# Altium schematic sheet Server_CPU_Power_Supplies.SchDoc
size D
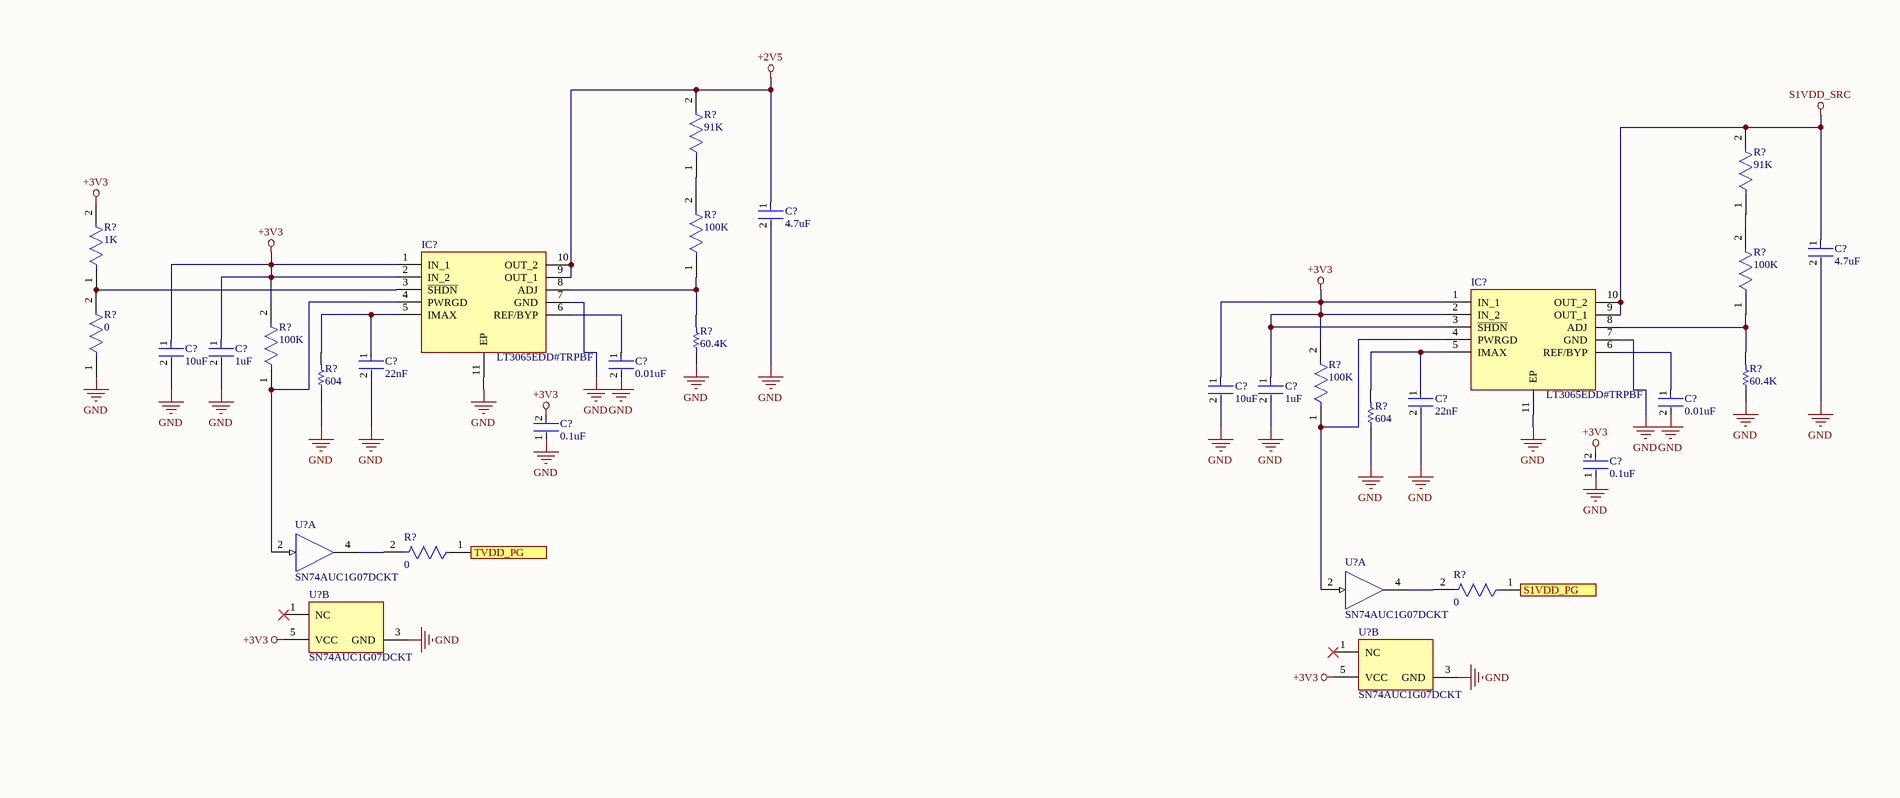
[diagram p0: Server_CPU_Power_Supplies.SchDoc, top left]
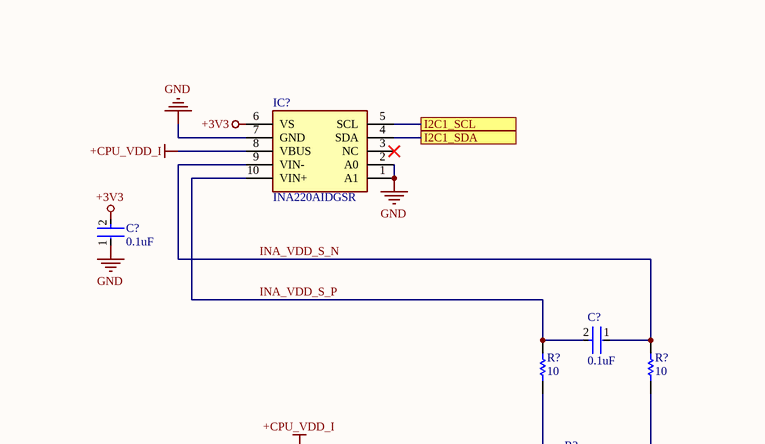
[diagram p1: Server_CPU_Power_Supplies.SchDoc, top right]
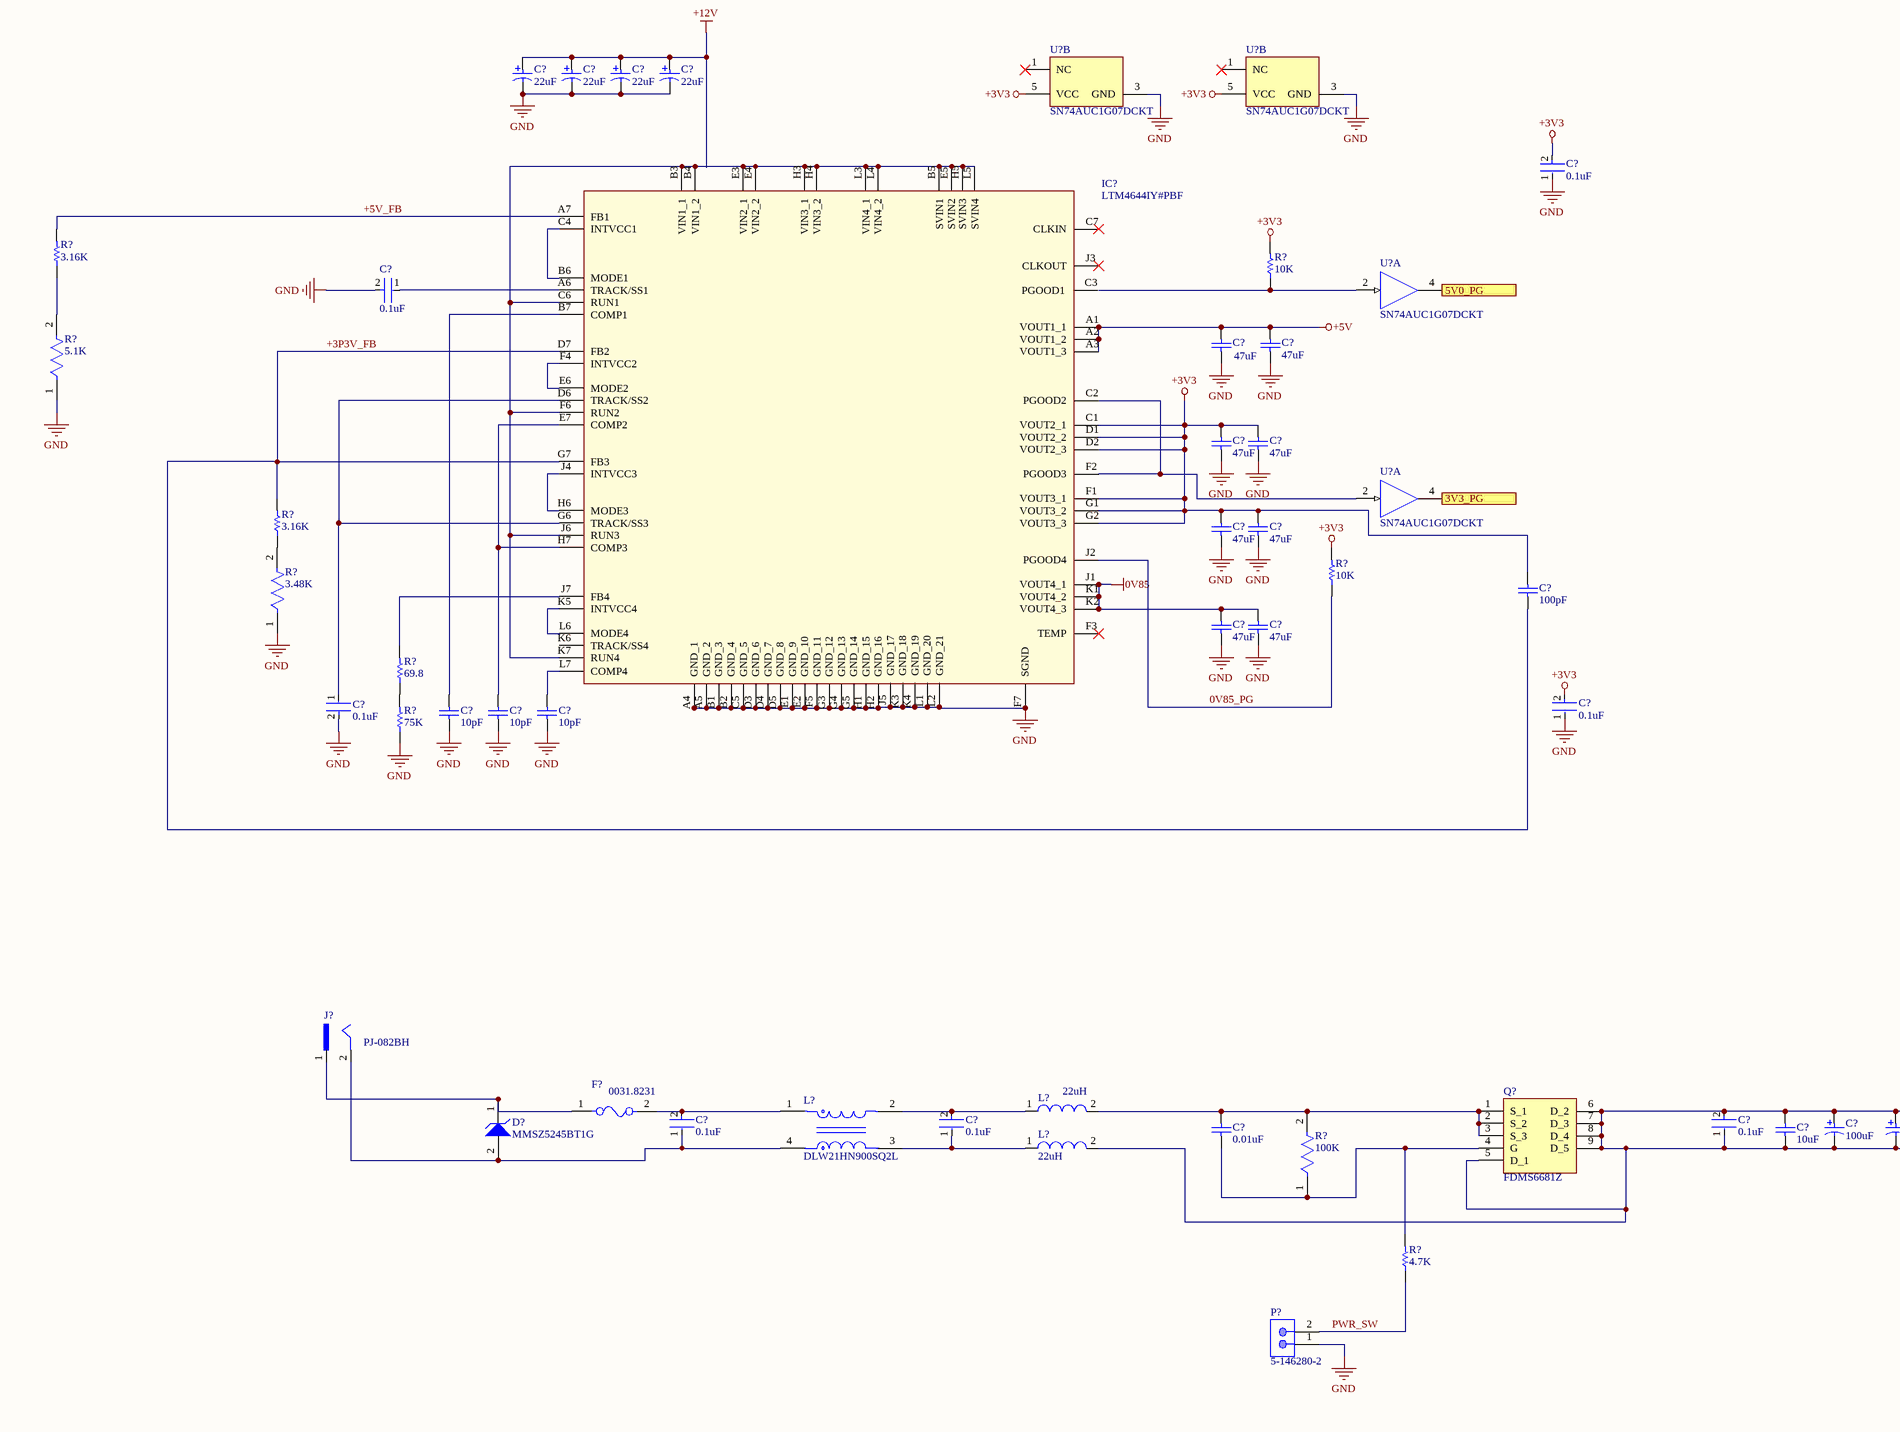
[diagram p2: Server_CPU_Power_Supplies.SchDoc, bottom left]
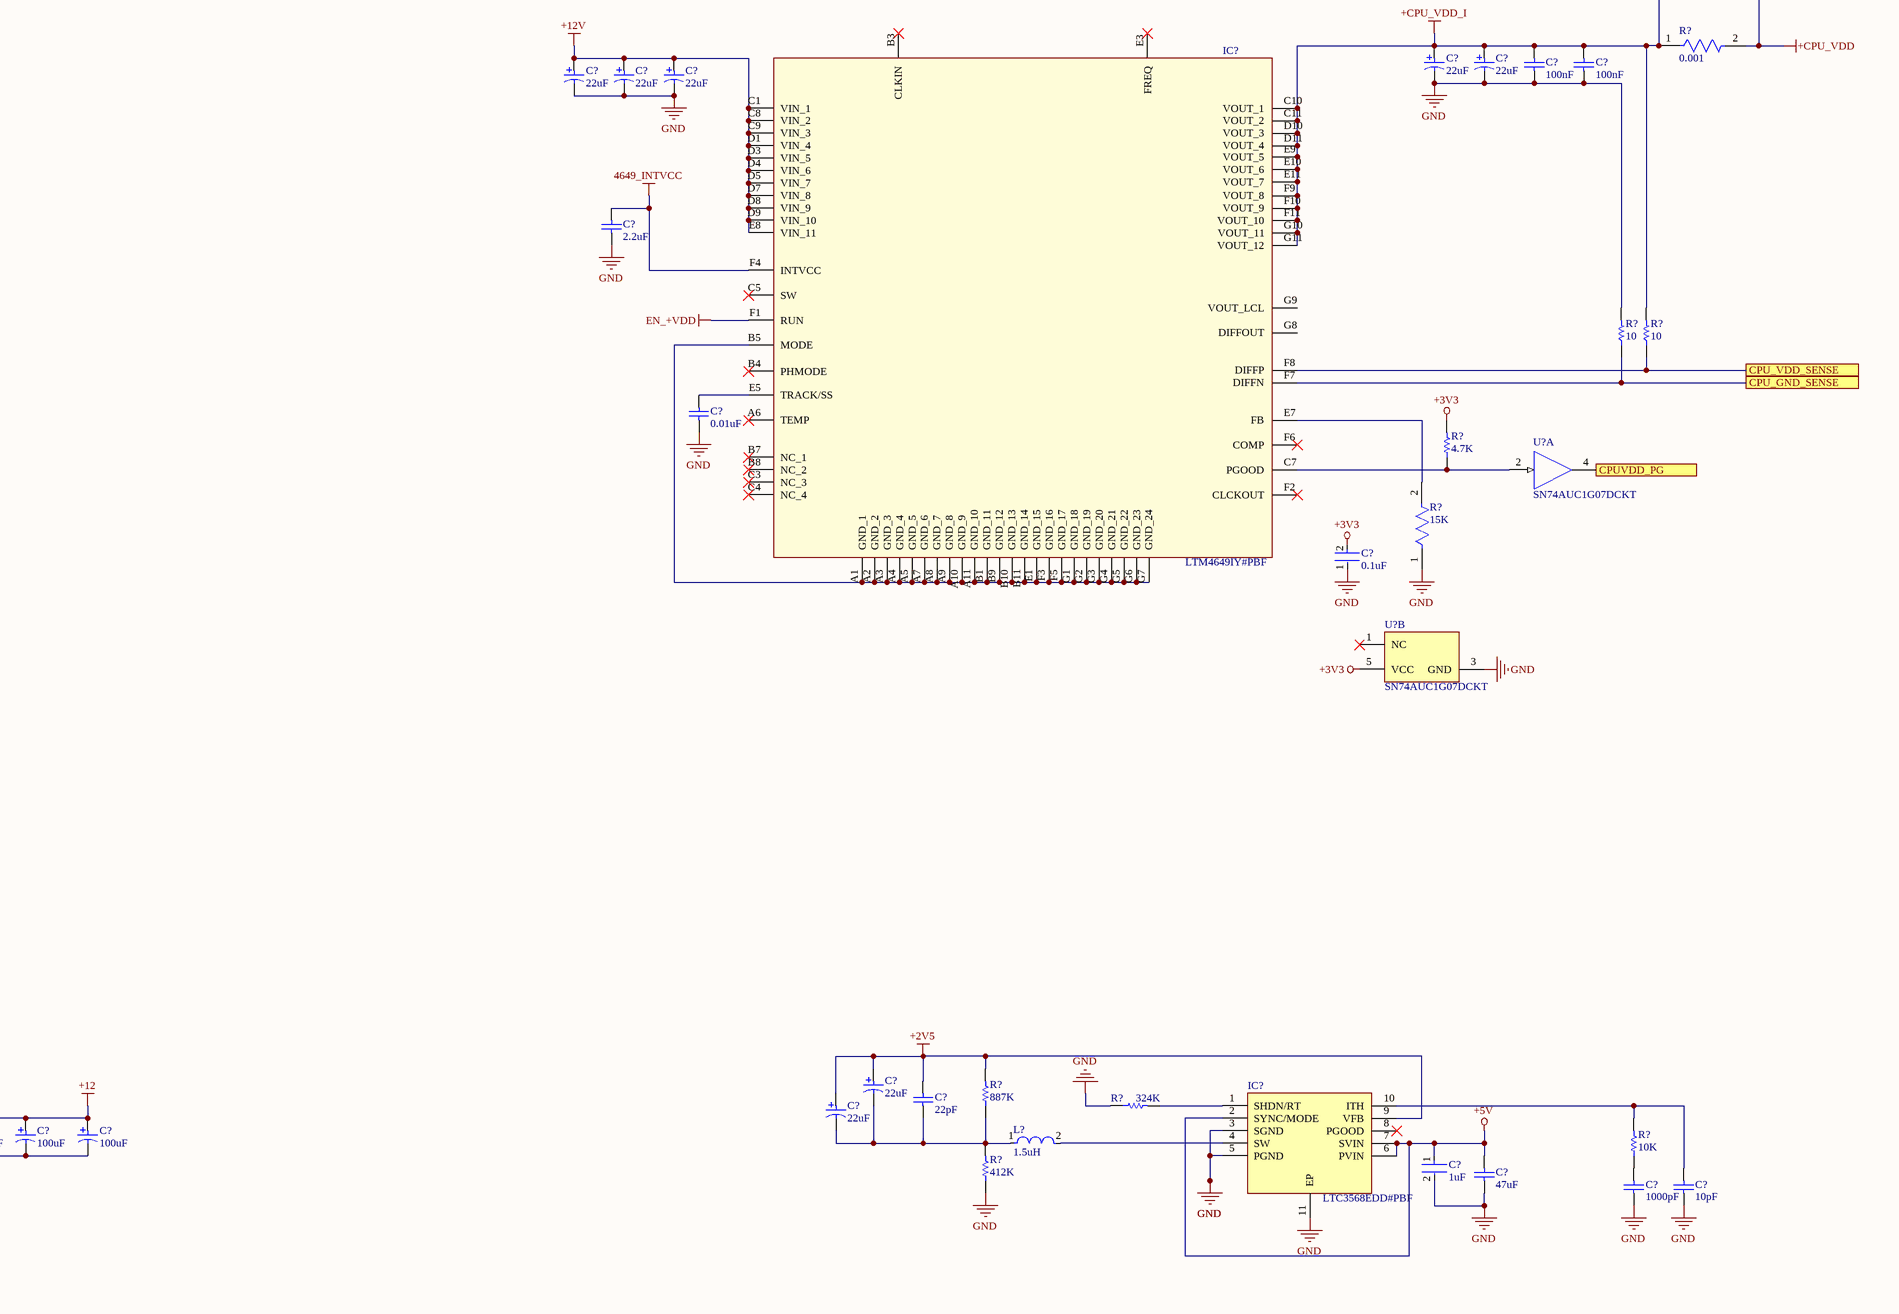
[diagram p3: Server_CPU_Power_Supplies.SchDoc, bottom right]

## Parts
(Parts that share a designator on the sheet are numbered #1, #2 ... from top to bottom, then left to right.)
C?#1  4.7uF  [FP-GRM155-0_1-IPC_B]
C?#2  4.7uF  [FP-GRM155-0_1-IPC_B]
C?#3  10uF  [FP-C0805C-DG-MFG]
C?#4  1uF  [FP-GRM15-0_1-MFG]
C?#5  22nF  [FP-CL288-IPC_C]
C?#6  0.01uF  [FP-C0402-BB-MFG]
C?#7  10uF  [FP-C0805C-DG-MFG]
C?#8  1uF  [FP-GRM15-0_1-MFG]
C?#9  22nF  [FP-CL288-IPC_C]
C?#10  0.01uF  [FP-C0402-BB-MFG]
C?#11  0.1uF  [FP-GRM15-MFG]
C?#12  0.1uF  [FP-GRM15-MFG]
C?#13  0.1uF  [FP-GRM15-MFG]
C?#14  0.1uF  [FP-GRM15-MFG]
C?#15  22uF  [AVX-TAJ-B-2_M]
C?#16  22uF  [AVX-TAJ-B-2_M]
C?#17  22uF  [AVX-TAJ-B-2_M]
C?#18  22uF  [AVX-TAJ-B-2_M]
C?#19  22uF  [AVX-TAJ-B-2_M]
C?#20  22uF  [AVX-TAJ-B-2_M]
C?#21  22uF  [AVX-TAJ-B-2_M]
C?#22  22uF  [AVX-TAJ-B-2_M]
C?#23  22uF  [AVX-TAJ-B-2_M]
C?#24  100nF  [CAPC3216X95X55ML15T25]
C?#25  100nF  [CAPC3216X95X55ML15T25]
C?#26  0.1uF  [FP-GRM15-MFG]
C?#27  2.2uF  [CAPC2013X140X50LL20T25]
C?#28  0.1uF  [FP-GRM15-MFG]
C?#29  47uF  [TAYO-JMK212BBJ476MG-T_L]
C?#30  47uF  [TAYO-JMK212BBJ476MG-T_L]
C?#31  0.01uF  [CAPC1005X56X25LL10T15]
C?#32  47uF  [TAYO-JMK212BBJ476MG-T_L]
C?#33  47uF  [TAYO-JMK212BBJ476MG-T_L]
C?#34  47uF  [TAYO-JMK212BBJ476MG-T_L]
C?#35  47uF  [TAYO-JMK212BBJ476MG-T_L]
C?#36  0.1uF  [FP-GRM15-MFG]
C?#37  100pF  [CAPC1005X55X25ML05T10]
C?#38  47uF  [TAYO-JMK212BBJ476MG-T_L]
C?#39  47uF  [TAYO-JMK212BBJ476MG-T_L]
C?#40  0.1uF  [FP-GRM15-MFG]
C?#41  0.1uF  [FP-GRM15-MFG]
C?#42  10pF  [CAPC1005X55X25ML05T10]
C?#43  10pF  [CAPC1005X55X25ML05T10]
C?#44  10pF  [CAPC1005X55X25ML05T10]
C?#45  22uF  [AVX-TAJ-B-2_M]
C?#46  22uF  [AVX-TAJ-B-2_M]
C?#47  22pF  [CAPC1005X55X25ML05T10]
C?#48  0.1uF  [FP-GRM15-MFG]
C?#49  0.1uF  [FP-GRM15-MFG]
C?#50  0.1uF  [FP-GRM15-MFG]
C?#51  100uF  [PNSC-FK-V-D8_V]
C?#52  100uF  [PNSC-FK-V-D8_V]
C?#53  100uF  [PNSC-FK-V-D8_V]
C?#54  0.01uF  [CAPC1005X56X25LL10T15]
C?#55  10uF  [CAPC1210(3225)190_N]
C?#56  1uF  [FP-GRM15-0_1-MFG]
C?#57  47uF  [CAPC1206(3216)190_N]
C?#58  1000pF  [CAPC1005X55X25ML5T10]
C?#59  10pF  [CAPC1005X55X25ML05T10]
D?  MMSZ5245BT1G  [ONSC-SOD-123-2-425-04_V]
F?  0031.8231  [FP-0031_8231-MFG]
IC?#1  LT3065EDD#TRPBF  [SON50P300X300X80-11N-D]
IC?#2  LT3065EDD#TRPBF  [SON50P300X300X80-11N-D]
IC?#3  INA220AIDGSR  [SOP50P490X110-10N]
IC?#4  LTM4649IY#PBF  [BGA68C127P11X7_1500X900X512]
IC?#5  LTM4644IY#PBF  [BGA77C127P7X11_900X1500X521]
IC?#6  LTC3568EDD#PBF  [SON50P300X300X80-11N-D]
J?  PJ-082BH  [CUI_PJ-082BH]
L?#1  22uH  [WE-HCI-1365]
L?#2  DLW21HN900SQ2L  [FP-DLW21HN-MFG]
L?#3  22uH  [WE-HCI-1365]
L?#4  1.5uH  [FP-IHLP-6767GZ-FP_3_825x1-MFG]
P?  5-146280-2  [TECO-5-146280-2_V]
Q?  FDMS6681Z  [FDMS6681Z]
R?#1  91K  [FP-CRCW0402-e3-IPC_B]
R?#2  91K  [FP-CRCW0402-e3-IPC_B]
R?#3  100K  [FP-CRCW0402-e3-IPC_C]
R?#4  1K  [FP-CRCW0402-e3-MFG]
R?#5  100K  [FP-CRCW0402-e3-IPC_C]
R?#6  60.4K  [RESC1005X40X25NL05T05]
R?#7  0  [FP-CRCW0402-e3-IPC_C]
R?#8  100K  [FP-CRCW0402-e3-IPC_C]
R?#9  604  [RESC1005X40X25ML05T05]
R?#10  60.4K  [RESC1005X40X25NL05T05]
R?#11  100K  [FP-CRCW0402-e3-IPC_C]
R?#12  604  [RESC1005X40X25ML05T05]
R?#13  0  [FP-CRCW0402-e3-IPC_C]
R?#14  0  [FP-CRCW0402-e3-IPC_C]
R?#15  10  [RESC1005X40X25LL05T05]
R?#16  10  [RESC1005X40X25LL05T05]
R?#17  0.001  [FP-HCS3920FT1L00-MFG]
R?#18  3.16K  [RESC1005X35X20NL05T10]
R?#19  10K  [RESC1005X40X25LL05T05]
R?#20  10  [RESC1005X40X25LL05T05]
R?#21  10  [RESC1005X40X25LL05T05]
R?#22  5.1K  [FP-CRCW0402-e3-IPC_C]
R?#23  4.7K  [RESC1005X40X25ML05T05]
R?#24  3.16K  [RESC1005X35X20NL05T10]
R?#25  15K  [FP-ERJ2R-MFG]
R?#26  10K  [RESC1005X40X25LL05T05]
R?#27  3.48K  [FP-CRCW0402-e3-IPC_C]
R?#28  69.8  [RESC1005X40X25LL05T05]
R?#29  75K  [RESC1005X40X25LL05T05]
R?#30  887K  [RESC1005X40X25ML05T05]
R?#31  324K  [RESC1005X40X25LL05T05]
R?#32  10K  [RESC1005X40X25LL05T05]
R?#33  412K  [RESC1005X40X25LL05T05]
R?#34  100K  [FP-CRCW0805-e3-MFG]
R?#35  4.7K  [RESC1005X40X25LL05T05]
U?#1  SN74AUC1G07DCKT  [DCK0005A_M]  (part A of 2)
U?#2  SN74AUC1G07DCKT  [DCK0005A_M]  (part A of 2)
U?#3  SN74AUC1G07DCKT  [DCK0005A_M]  (part B of 2)
U?#4  SN74AUC1G07DCKT  [DCK0005A_M]  (part B of 2)
U?#5  SN74AUC1G07DCKT  [DCK0005A_M]  (part B of 2)
U?#6  SN74AUC1G07DCKT  [DCK0005A_M]  (part B of 2)
U?#7  SN74AUC1G07DCKT  [DCK0005A_M]  (part A of 2)
U?#8  SN74AUC1G07DCKT  [DCK0005A_M]  (part A of 2)
U?#9  SN74AUC1G07DCKT  [DCK0005A_M]  (part A of 2)
U?#10  SN74AUC1G07DCKT  [DCK0005A_M]  (part B of 2)

## Ports
3V3_PG, 5V0_PG, CPU_GND_SENSE, CPU_VDD_SENSE, CPUVDD_PG, I2C1_SCL, I2C1_SDA, S1VDD_PG, TVDD_PG

## Nets
0V85: C?#38.2 C?#39.2 IC?#5.J1(VOUT4_1) IC?#5.K1(VOUT4_2) IC?#5.K2(VOUT4_3)
4649_INTVCC: C?#27.2 IC?#4.F4(INTVCC)
+2V5: C?#1.1 C?#45.1 C?#46.1 C?#47.2 IC?#1.9(OUT_1) IC?#1.10(OUT_2) IC?#6.9(VFB) R?#1.2 R?#30.2
+3V3: C?#3.1 C?#4.1 C?#7.1 C?#8.1 C?#11.2 C?#12.2 C?#13.2 C?#26.2 C?#32.2 C?#33.2 C?#34.2 C?#35.2 C?#36.2 C?#37.2 C?#40.2 IC?#1.1(IN_1) IC?#1.2(IN_2) IC?#2.1(IN_1) IC?#2.2(IN_2) IC?#2.3(~{SHDN}) IC?#3.6(VS) IC?#5.C1(VOUT2_1) IC?#5.D1(VOUT2_2) IC?#5.D2(VOUT2_3) IC?#5.F1(VOUT3_1) IC?#5.G1(VOUT3_2) IC?#5.G2(VOUT3_3) R?#4.2 R?#8.2 R?#11.2 R?#19.2 R?#23.2 R?#26.2 U?#3.5(VCC) U?#4.5(VCC) U?#5.5(VCC) U?#6.5(VCC) U?#10.5(VCC)
+5V: C?#29.2 C?#30.2 C?#56.1 C?#57.2 IC?#5.A1(VOUT1_1) IC?#5.A2(VOUT1_2) IC?#5.A3(VOUT1_3) IC?#6.2(SYNC/MODE) IC?#6.6(PVIN) IC?#6.7(SVIN)
+12: C?#50.1 C?#50.2 C?#51.1 C?#51.2 C?#52.1 C?#52.2 C?#53.1 C?#53.2 C?#55.1 C?#55.2 L?#3.2 Q?.5(D_1) Q?.6(D_2) Q?.7(D_3) Q?.8(D_4) Q?.9(D_5)
+12V: C?#15.1 C?#16.1 C?#17.1 C?#18.1 C?#21.1 C?#22.1 C?#23.1 IC?#4.C1(VIN_1) IC?#4.C8(VIN_2) IC?#4.C9(VIN_3) IC?#4.D1(VIN_4) IC?#4.D3(VIN_5) IC?#4.D4(VIN_6) IC?#4.D5(VIN_7) IC?#4.D7(VIN_8) IC?#4.D8(VIN_9) IC?#4.D9(VIN_10) IC?#4.E8(VIN_11)
+CPU_VDD: R?#16.1 R?#17.2
+CPU_VDD_I: C?#19.1 C?#20.1 C?#24.2 C?#25.2 IC?#3.8(VBUS) IC?#4.C10(VOUT_1) IC?#4.C11(VOUT_2) IC?#4.D10(VOUT_3) IC?#4.D11(VOUT_4) IC?#4.E9(VOUT_5) IC?#4.E10(VOUT_6) IC?#4.E11(VOUT_7) IC?#4.F9(VOUT_8) IC?#4.F10(VOUT_9) IC?#4.F11(VOUT_10) IC?#4.G10(VOUT_11) IC?#4.G11(VOUT_12) R?#15.1 R?#17.1 R?#21.2
EN_+VDD: IC?#4.F1(RUN)
GND: C?#1.2 C?#2.2 C?#3.2 C?#4.2 C?#5.2 C?#6.2 C?#7.2 C?#8.2 C?#9.2 C?#10.2 C?#11.1 C?#12.1 C?#13.1 C?#15.2 C?#16.2 C?#17.2 C?#18.2 C?#19.2 C?#20.2 C?#21.2 C?#22.2 C?#23.2 C?#24.1 C?#25.1 C?#26.1 C?#27.1 C?#28.2 C?#29.1 C?#30.1 C?#31.1 C?#32.1 C?#33.1 C?#34.1 C?#35.1 C?#36.1 C?#38.1 C?#39.1 C?#40.1 C?#41.2 C?#42.1 C?#43.1 C?#44.1 C?#56.2 C?#57.1 C?#58.1 C?#59.1 IC?#1.7(GND) IC?#1.11(EP) IC?#2.7(GND) IC?#2.11(EP) IC?#3.1(A1) IC?#3.2(A0) IC?#3.7(GND) IC?#5.A4(GND_1) IC?#5.A5(GND_2) IC?#5.B1(GND_3) IC?#5.B2(GND_4) IC?#5.C5(GND_5) IC?#5.D3(GND_6) IC?#5.D4(GND_7) IC?#5.D5(GND_8) IC?#5.E1(GND_9) IC?#5.E2(GND_10) IC?#5.F5(GND_11) IC?#5.F7(SGND) IC?#5.G3(GND_12) IC?#5.G4(GND_13) IC?#5.G5(GND_14) IC?#5.H1(GND_15) IC?#5.H2(GND_16) IC?#5.J5(GND_17) IC?#5.K3(GND_18) IC?#5.K4(GND_19) IC?#5.L1(GND_20) IC?#5.L2(GND_21) IC?#6.3(SGND) IC?#6.5(PGND) IC?#6.11(EP) P?.1 R?#6.1 R?#7.1 R?#9.1 R?#10.1 R?#12.1 R?#20.2 R?#22.1 R?#25.1 R?#27.1 R?#29.1 R?#31.1 R?#33.1 U?#3.3(GND) U?#4.3(GND) U?#5.3(GND) U?#6.3(GND) U?#10.3(GND)
S1VDD_SRC: C?#2.1 IC?#2.9(OUT_1) IC?#2.10(OUT_2) R?#2.2
0V85_PG: IC?#5.J2(PGOOD4) R?#26.1
3V3_PG: U?#9.4(Y) ; port 3V3_PG
5V0_PG: U?#7.4(Y) ; port 5V0_PG
+3P3V_FB: C?#37.1 IC?#5.D7(FB2) IC?#5.G7(FB3) R?#24.2
+5V_FB: IC?#5.A7(FB1) R?#18.2
CPU_GND_SENSE: IC?#4.F7(DIFFN) R?#20.1 ; port CPU_GND_SENSE
CPU_VDD_SENSE: IC?#4.F8(DIFFP) R?#21.1 ; port CPU_VDD_SENSE
CPUVDD_PG: U?#8.4(Y) ; port CPUVDD_PG
I2C1_SCL: IC?#3.5(SCL) ; port I2C1_SCL
I2C1_SDA: IC?#3.4(SDA) ; port I2C1_SDA
INA_VDD_S_N: C?#14.1 IC?#3.9(VIN-) R?#16.2
INA_VDD_S_P: C?#14.2 IC?#3.10(VIN+) R?#15.2
PWR_SW: P?.2 R?#35.1
S1VDD_PG: R?#14.1 ; port S1VDD_PG
TVDD_PG: R?#13.1 ; port TVDD_PG
NetC?#5_1: C?#5.1 IC?#1.5(IMAX) R?#9.2
NetC?#6_1: C?#6.1 IC?#1.6(REF/BYP)
NetC?#9_1: C?#9.1 IC?#2.5(IMAX) R?#12.2
NetC?#10_1: C?#10.1 IC?#2.6(REF/BYP)
NetC?#28_1: C?#28.1 IC?#5.A6(TRACK/SS1)
NetC?#31_2: C?#31.2 IC?#4.E5(TRACK/SS)
NetC?#41_1: C?#41.1 IC?#5.D6(TRACK/SS2) IC?#5.G6(TRACK/SS3)
NetC?#42_2: C?#42.2 IC?#5.B7(COMP1)
NetC?#43_2: C?#43.2 IC?#5.E7(COMP2) IC?#5.H7(COMP3)
NetC?#44_2: C?#44.2 IC?#5.L7(COMP4)
NetC?#45_2: C?#45.2 C?#46.2 C?#47.1 L?#4.1 R?#30.1 R?#33.2
NetC?#48_1: C?#48.1 D?.2(A) J?.2 L?#2.4
NetC?#48_2: C?#48.2 F?.2 L?#2.1
NetC?#49_1: C?#49.1 L?#2.3 L?#3.1
NetC?#49_2: C?#49.2 L?#1.1 L?#2.2
NetC?#54_1: C?#54.1 Q?.4(G) R?#34.1 R?#35.2
NetC?#54_2: C?#54.2 L?#1.2 Q?.1(S_1) Q?.2(S_2) Q?.3(S_3) R?#34.2
NetC?#58_2: C?#58.2 R?#32.1
NetC?#59_2: C?#59.2 IC?#6.10(ITH) R?#32.2
NetD?_1: D?.1(K) F?.1 J?.1
NetIC?#1_3: IC?#1.3(~{SHDN}) R?#4.1 R?#7.2
NetIC?#1_4: IC?#1.4(PWRGD) R?#8.1 U?#1.2(A)
NetIC?#1_8: IC?#1.8(ADJ) R?#3.1 R?#6.2
NetIC?#2_4: IC?#2.4(PWRGD) R?#11.1 U?#2.2(A)
NetIC?#2_8: IC?#2.8(ADJ) R?#5.1 R?#10.2
NetIC?#4_A1: IC?#4.A1(GND_1) IC?#4.A2(GND_2) IC?#4.A3(GND_3) IC?#4.A4(GND_4) IC?#4.A5(GND_5) IC?#4.A7(GND_6) IC?#4.A8(GND_7) IC?#4.A9(GND_8) IC?#4.A10(GND_9) IC?#4.A11(GND_10) IC?#4.B1(GND_11) IC?#4.B5(MODE) IC?#4.B9(GND_12) IC?#4.B10(GND_13) IC?#4.B11(GND_14) IC?#4.E1(GND_15) IC?#4.F3(GND_16) IC?#4.F5(GND_17) IC?#4.G1(GND_18) IC?#4.G2(GND_19) IC?#4.G3(GND_20) IC?#4.G4(GND_21) IC?#4.G5(GND_22) IC?#4.G6(GND_23) IC?#4.G7(GND_24)
NetIC?#4_C7: IC?#4.C7(PGOOD) R?#23.1 U?#8.2(A)
NetIC?#4_E7: IC?#4.E7(FB) R?#25.2
NetIC?#5_B3: IC?#5.B3(VIN1_1) IC?#5.B4(VIN1_2) IC?#5.B5(SVIN1) IC?#5.C6(RUN1) IC?#5.E3(VIN2_1) IC?#5.E4(VIN2_2) IC?#5.E5(SVIN2) IC?#5.F6(RUN2) IC?#5.H3(VIN3_1) IC?#5.H4(VIN3_2) IC?#5.H5(SVIN3) IC?#5.J6(RUN3) IC?#5.K7(RUN4) IC?#5.L3(VIN4_1) IC?#5.L4(VIN4_2) IC?#5.L5(SVIN4)
NetIC?#5_B6: IC?#5.B6(MODE1) IC?#5.C4(INTVCC1)
NetIC?#5_C2: IC?#5.C2(PGOOD2) IC?#5.F2(PGOOD3) U?#9.2(A)
NetIC?#5_E6: IC?#5.E6(MODE2) IC?#5.F4(INTVCC2)
NetIC?#5_H6: IC?#5.H6(MODE3) IC?#5.J4(INTVCC3)
NetIC?#5_J7: IC?#5.J7(FB4) R?#28.2
NetIC?#5_K5: IC?#5.K5(INTVCC4) IC?#5.L6(MODE4)
NetIC?#6_1: IC?#6.1(SHDN/RT) R?#31.2
NetIC?#6_4: IC?#6.4(SW) L?#4.2
NetR?#1_1: R?#1.1 R?#3.2
NetR?#2_1: R?#2.1 R?#5.2
NetR?#13_2: R?#13.2 U?#1.4(Y)
NetR?#14_2: R?#14.2 U?#2.4(Y)
NetR?#18_1: R?#18.1 R?#22.2
NetR?#19_1: R?#19.1 U?#7.2(A)
NetR?#24_1: R?#24.1 R?#27.2
NetR?#28_1: R?#28.1 R?#29.2

Not connected (* = marked no-connect by the designer): IC?#3 3(NC)*; IC?#4 A6(TEMP)* B3(CLKIN)* B4(PHMODE)* B7(NC_1)* B8(NC_2)* C3(NC_3)* C4(NC_4)* C5(SW)* E3(FREQ)* F2(CLCKOUT)* F6(COMP)* G8(DIFFOUT) G9(VOUT_LCL); IC?#5 C3(PGOOD1) C7(CLKIN)* F3(TEMP)* J3(CLKOUT)* K6(TRACK/SS4); IC?#6 8(PGOOD)*; U?#3 1(NC)*; U?#4 1(NC)*; U?#5 1(NC)*; U?#6 1(NC)*; U?#10 1(NC)*

## Notes on the sheet
- Title
- Size:
- Date:
- File:
- D
- Number:
- Time:
- Revision:
- Sheet
- of

## Library data of the parts
C?#1 C?#2 = CMP-2008-04549-2: Chip Multilayer Ceramic Capacitors for General Purpose, 0402, 4.7uF, X5R, 15%, 20%, 6.3V; Height: 0.5mm; Weight: 0.000212oz; Length: 1mm; Case Code (Metric): 1005; Packaging: Tape and Reel; Termination: SMD/SMT; Dielectric: X5R; Depth: 0.5mm; Case Code (Imperial): 0402; Min Operating Temperature: -55°C; Case/Package: 0402; Voltage: 6.3V; Width: 0.02inch; Capacitance: 4.7uF; Lead Free: Lead Free; Thickness: 0.022inch; Contact Plating: Tin; REACH SVHC: No SVHC; Package Quantity: 10000; Tolerance: 20%; Voltage Rating (DC): 6.3V; Voltage Rating: 6.3V; Mount: Surface Mount; Max Operating Temperature: 85°C
C?#3 C?#7 = CMP-2007-03243-2: CAP CER 10UF 10V X5R 0805; Manufacturer Part Number: C0805C106K8PACTU; Manufacturer: Kemet; 3DS Part Number: 220-00001; Tolerance: 10%; Temperature Coefficient: 15%; Material: Ceramic; Device Class L2: Capacitors; Device Class L1: Passive Components; ComponentLink2URL: https://content.kemet.com/datasheets/KEM_C1006_X5R_SMD.pdf; Height: 1.4mm; Lead Free: Yes; Digikey Description: CAP CER 10UF 10V X5R 0805; Octopart: https://octopart.com/c0805c106k8pactu-kemet-98697; Capacitance: 10uF; Value: 10uF; Temperature Range Low: -55°C; Temperature: -55°C to +85°C; Automotive: No; Mouser Description: CAP CER 10UF 10V X5R 0805; Ipc Land Pattern Name: CAPC200125X125; Temperature Range High: +85°C; Voltage: 10V; RoHS: TRUE; Device Class L3: Ceramic Capacitors; ComponentLink2Description: Datasheet; Voltage Rating: 10V; Package: C0805C-DG; Temperature Characteristic: X5R; Category: Cap
C?#4 C?#8 C?#56 = CMP-2008-04556-2: CAP CER 1UF 10V X5R 0402; Manufacturer Part Number: GRM155R61A105KE15D; Manufacturer: Murata; Material: Ceramic; Tolerance: 10%; Temperature Coefficient: 15%; Octopart: https://octopart.com/grm155r61a105ke15d-murata-197442; Lead Free: Yes; ComponentLink2Description: Datasheet; Temperature: -55°C to +85°C; Temperature Range High: +85°C; Height: 0.55mm; Capacitance: 1uF; Ipc Land Pattern Name: CAPC10050X50; ComponentLink2URL: https://search.murata.co.jp/Ceramy/image/img/A01X/G101/ENG/GRM155R61A105KE15-01A.pdf; Temperature Range Low: -55°C; Device Class L2: Capacitors; Voltage Rating: 10V; RoHS: TRUE; Device Class L1: Passive Components; Device Class L3: Ceramic Capacitors; Temperature Characteristic: X5R; Mouser Description: 0402 1 uF 10 V ±10% Tolerance X5R Surface Mount Multilayer Ceramic Capacitor; Automotive: No; Package: GRM15-0.1; Digikey Description: CAP CER 1UF 10V X5R 0402; Value: 1uF; Category: Cap
C?#5 C?#9 = CMP-13271-003253-1: Cap Ceramic 22nF 16V X7R ±10% SMD 0402 +125°C Paper T/R; Width: 0.02inch; Mount: Surface Mount; Radiation Hardening: No; Case Code (Imperial): 0402; Thickness: 0.022inch; Height: 0.5mm; Tolerance: 10%; Length: 1mm; Packaging: Tape and Reel; Contact Plating: Tin; Case/Package: 0402; Min Operating Temperature: -55°C; Voltage: 16V; Voltage Rating: 16V; Package Quantity: 1; Case Code (Metric): 1005; Depth: 0.5mm; Capacitance: 22nF; Max Operating Temperature: 125°C; Dielectric: X7R
C?#6 C?#10 = CMP-2008-03072-2: CAP CER 10000PF 16V X7R 0402; Manufacturer Part Number: C0402C103K4RACTU; Manufacturer: Kemet; Tolerance: 0.1; Material: Ceramic; Value: 10,000 pF; Temperature Coefficient: 15%; Package: C0402-BB; Height: 0.55mm; Temperature Range Low: -55°C; Lead Free: Yes; Mouser Description: Capacitor; Ceramic; Cap; .010uF; Tol 10%; SMT; Vol-Rtg 16V; X7R; Tape and Reel; RoHS: TRUE; Capacitance: 10,000 pF; Device Class L3: Ceramic Capacitors; Voltage Rating: 16 V; Automotive: No; Temperature: -55°C to +125°C; Digikey Description: CAP CER 10000PF 16V X7R 0402; Temperature Characteristic: X7R; Temperature Range High: +125°C; Category: Cap; Ipc Land Pattern Name: CAPC10050X50; ComponentLink2URL: https://content.kemet.com/datasheets/KEM_C1002_X7R_SMD.pdf; Octopart: https://octopart.com/c0402c103k4ractu-kemet-130896; ComponentLink2Description: Datasheet; Device Class L1: Passive Components; Device Class L2: Capacitors
C?#11-C?#14 C?#26 C?#28 C?#36 C?#40 C?#41 C?#48-C?#50 = CMP-2100-03641-2: CAP CER 0.1UF 16V X7R 0402; Manufacturer Part Number: GRM155R71C104KA88D; Manufacturer: Murata; Standoff Height: 0mm; Tolerance: 10%; Voltage Rating: 16Vdc; Material: Ceramic; Capacitance: 0.10μF; Value: 0.10μF; RoHS: TRUE; Temperature Characteristic: X7R; Octopart: https://octopart.com/grm155r71c104ka88d-murata-196880; Digikey Description: CAP CER 0.1UF 16V X7R 0402; Device Class L3: Ceramic Capacitors; Height: 0.55mm; ComponentLink2Description: Datasheet; Temperature Range Low: -55°C; Ipc Land Pattern Name: CAPC10050X219; ComponentLink2URL: https://search.murata.co.jp/Ceramy/image/img/A01X/G101/ENG/GRM155R71H471KA01-01A.pdf; Device Class L1: Passive Components; Lead Free: yes; Category: Cap; Package: GRM15; Temperature: -55°C to +125°C; Device Class L2: Capacitors; Temperature Range High: +125°C; Mouser Description: 0402 0.1 uF 16V ±10 % Tolerance X7R SMT Multilayer Ceramic Capacitor
C?#15-C?#23 C?#45 C?#46 = CMP-2100-03689-1: Standard Tantalum, 22 uF, +/- 10%, 16 V, -55 to 125 degC, 2-Pin SMD (1210), RoHS, Tape and Reel; Manufacturer: AVX; Leakage Current: 3.5uA; Dissipation Factor: 6%; Voltage Rating (DC): 16V; ESR (Equivalent Series Resistance): 2.3Ohm; Polarity: Polar; Package Quantity: 1; Tolerance: 10%; Number of Pins: 2; Manufacturer URL: http://www.avx.com/; Height - Seated (Max): 0.083inch; Case Code (Imperial): 1210; Package Reference: TAJ-B-2; Height: 1.9mm; Depth: 2.8mm; Packaging: TapeandReel; Termination: SMD/SMT; Case/Package: 1210; Lead Free: LeadFree; Min Operating Temperature: -55degC; Capacitance: 22uF; RoHSCompliant: True; Dielectric Material: Tantalum; Case Code (Metric): 3528; Width: 2.8mm; Datasheet URL: http://datasheets.avx.com/TAJ.pdf; Radiation Hardening: No; Package Description: 2-Pin Surface Mount Device, Body 3.5 x 2.85 mm; Length: 3.5mm; Voltage Rating: 16V; Datasheet Version: 42401.0; Max Operating Temperature: 125degC; REACH SVHC: NoSVHC; Voltage: 16V
C?#24 C?#25 = CMP-1662-00007-4: Chip Capacitor, 0.1 uF, +/- 10%, 50 V, -55 to 125 degC, 1206 (3216 Metric), RoHS, Tape and Reel; Manufacturer: Murata; Voltage Rating: 50 V; Lead Pitch: 4 mm; PackageDescription: 2-Pin Surface Mount Device, Body 3.2 x 1.6 mm; DatasheetVersion: 03/2016; Min Operating Temperature: -55 degC; Package Quantity: 4000; RoHSCompliant: true; Max Operating Temperature: 125 degC; Height: 0.85 mm; Pins: 2; Length: 3.2 mm; PackageReference: 1206 (3216 Metric); Mounting Technology: Surface Mount; ComponentLink1Description: Manufacturer URL; ComponentLink2Description: Datasheet; ComponentLink1URL: http://www.murata.com/; Mount: Surface Mount; REACH SVHC: No SVHC; Packaging: Tape and Reel; ComponentLink2URL: http://search.murata.co.jp/Ceramy/image/img/A01X/G101/ENG/GRM319R71H104KA01-01.pdf
C?#27 = CMP-2000-05810-1: Chip Capacitor, 2.2 uF, +/- 10%, 10 V, -55 to 85 degC, 0805 (2012 Metric), RoHS, Tape and Reel; Manufacturer: AVX; Dielectric: X5R; Rated Voltage: 10V; Capacitance: 2.2µF; Tolerance (%): ±10%; Datasheet Version: 05/2016; Manufacturer URL: http://www.avx.com/; Package Description: 2-Pin Surface Mount Device, Body 2.01 x 1.25 mm; Mounting Technology: SurfaceMount; Case Size/Dimension: 0805; Package Reference: 0805; Datasheet URL: http://datasheets.avx.com/cx5r.pdf
C?#29 C?#30 C?#32-C?#35 C?#38 C?#39 = CMP-2000-06498-1: High Value Multilayer Ceramic Capacitor, 47 uF, +/-20%, 6.3 V, -55 to 85 degC, 2-Pin SMD (0805), RoHS, Tape and Reel; Manufacturer: Taiyo Yuden; PCN Part Number: X5R,X7RDielectrics23/Jan/2008; Kits: 587-1797-KIT-ND-KITCAPCERHICAP0603&0805S; Temperature Coefficient: X5R; Tolerance: ±20%; Online Catalog: MSeries; Other Names: 587-1779-1; Capacitance: 47µF; Voltage - Rated: 6.3V; Catalog Drawings: xMKSeries_0805_1.25; Operating Temperature: -55°C~85°C; Mounting Technology: SurfaceMount; Package Reference: 0805; Features: -; Lead Spacing: -; Lead Style: -; Family: CeramicCapacitors; Size / Dimension: 0.079"Lx0.049"W(2.00mmx1.25mm); Package Description: 2-Pin SMD, Body 2.2 x 1.45 mm; Mounting Type: SurfaceMount,MLCC; Package / Case: 0805(2012Metric); Series: M; Category: Capacitors; Packaging: CutTape(CT); Datasheet Version: 10/2015; Datasheet URL: http://datasheet.octopart.com/JMK212BJ476MG-T-Taiyo-Yuden-datasheet-62109412.pdf; Manufacturer URL: http://www.t-yuden.com/; Ratings: -; Height - Seated (Max): -; Standard Package: 1; Thickness (Max): 0.053"(1.35mm); Applications: GeneralPurpose
C?#31 C?#54 = CMP-2008-02796-1: Manufacturer: AVX Interconnect / Elco; Part Number: 0402YC103JAT2A
C?#37 = CMP-2008-03915-1: Manufacturer: Murata; Part Number: GRM1555C1H101JA01D
C?#42-C?#44 C?#59 = CMP-2008-04246-1: Part Number: GRM1555C1H100JZ01D; Manufacturer: Murata
C?#47 = CMP-2008-04304-1: Part Number: GRM1555C1H220JZ01D; Manufacturer: Murata
C?#51-C?#53 = CMP-2000-06206-1: Aluminum Electrolytic Capacitor, 100 uF, +/- 20%, 25 V, 2-Pin SMD (Size Code D8), -55 to 105 degC, RoHS, Tape and Reel; Manufacturer: Panasonic; Type: Can; Lifetime@Temperature: 2000Hrs@105°C; Capacitance: 100µF; Rated Voltage: 25V; Ripple Current: 280mA; Impedance: 0.34O; Case Size/Dimension: Ø6.3x7.7mm; Operating Temp-Max: 105°C; Series: FK; Package URL: http://industrial.panasonic.com/cdbs/www-data/pdf/RDE0000/DME0000COL48.pdf; Mounting Technology: SurfaceMount; Package Description: 2-Pin Electrolytic Aluminum Capacitor, Body 6.6 x 6.6 mm; Datasheet Version: 03/2016; Datasheet URL: http://industrial.panasonic.com/cdbs/www-data/pdf/RDE0000/ABA0000C1181.pdf; Manufacturer URL: http://www.panasonic.com/; Package Reference: FK-V-D8; Operating Temp Range: -55to+105°C
C?#55 = CMP-1038-02223-1: CAP 10uF 16V -20% to +80% 1210 (3225 Metric) Thickness 1.9mm SMD; Case-EIA: 1210; Case-Metric: 3225; Rated Voltage: 16 V; Tolerance: -20% to +80%; Value: 10uF; Technology: SMT; Max Thickness: 1.9 mm
C?#57 = CMP-1037-05002-1: CAP 47uF 10V ±20% 1206 (3216 Metric) Thickness 1.9mm SMD; Case-Metric: 3216; Case-EIA: 1206; Tolerance: Â±20%; Technology: SMT; Rated Voltage: 10 V; Value: 47uF; Max Thickness: 1.9 mm
C?#58 = CMP-1662-00017-1: Chip Capacitor, 1 nF, +/- 10%, 50 V, -55 to 125 degC, 0402 (1005 Metric), RoHS, Tape and Reel; Case\/Package: 0402; Type (Capacitors): X7R; Voltage Rating (DC): 50 V; Capacitance: 1 nF; Width: 0.5 mm; Pins: 2; REACH SVHC: No SVHC; Length: 1 mm; Height: 0.5 mm; PackageDescription: 2-Pin Surface Mount Device, Body 1 x 0.5 mm; DatasheetVersion: 07/2016; Mount: Surface Mount; ComponentLink2Description: Datasheet; Tolerance: 10%; ComponentLink2URL: http://psearch.en.murata.com/capacitor/product/GRM155R71H102KA01%23.pdf; ComponentLink1URL: http://www.murata.com/; Case Code (Metric): 1005; Package Quantity: 10000; Min Operating Temperature: -55 degC; Max Operating Temperature: 125 degC; Voltage Rating: 50 V; ComponentLink1Description: Manufacturer URL; Packaging: Tape and Reel; Radiation Hardening: No; RoHSCompliant: true; PackageReference: 0402; Mounting Technology: Surface Mount; Case Code (Imperial): 0402
D? = CMP-1060-00535-1: Zener Voltage Regulator, 500 mW, 2-Pin SOD-123, Pb-Free, Tape and Reel; Manufacturer: On Semiconductor; P Max (W): 0.5; VZ Typ (V): 15; ComponentLink3URL: http://www.onsemi.com/pub_link/Collateral/425-04.PDF; Packing: Tape and Reel; DatasheetVersion: Rev. 12; ComponentLink2URL: http://www.onsemi.com/pub_link/Collateral/MMSZ5221BT1-D.PDF; Mounting Technology: Surface Mount; ComponentLink1Description: Manufacturer URL; ComponentLink1URL: http://www.onsemi.com/; ComponentLink2Description: Datasheet; PackageVersion: Rev. G, 10/2009; PackageReference: SOD-123-2-425-04; PackageDescription: 2-Pin SOD, Body 1.6 x 2.69 mm; ComponentLink3Description: Package Specification; RoHS: Pb-Free; PartNumber: MMSZ5245BT1G
F? = CMP-26292-000005-1: FUSE BLOK CARTRIDGE 600V 16A PCB; Manufacturer: Schurter; Voltage Rating Ac: 500V; Number Of Fuses: 1; Standoff Height: 0.7mm; Conn Orientation: Horizontal; ComponentLink2URL: https://www.schurter.com/en/datasheet/typ_OGD.pdf; Voltage Rating Dc: 600V; Package: 0; Device Class L3: unset; Digikey Description: FUSE BLOK CARTRIDGE 600V 16A PCB; Mouser Description: Fuse Holder OGD FUSEHOLDER 5X20/6.3X32; Category: Fuse; Device Class L2: Fuse Holders; Height: 12.7mm; ComponentLink2Description: Datasheet; Ambient Temperature Range Low: -40°C; Ambient Temperature Range High: +85°C; Octopart: https://octopart.com/0031.8231-schurter-8659; Automotive: No; RoHS: TRUE; Fuse Current: 16A; Lead Free: Yes; Device Class L1: Circuit Protection; Manufacturer Part Number: 0031.8231
IC?#1 IC?#2 = LT3065EDD#TRPBF: Integrated Circuit; Manufacturer_Name: Analog Devices; Datasheet Link: http://www.linear.com/docs/44316; Height: 0.8mm; Manufacturer_Part_Number: LT3065EDD#TRPBF; Mouser Part Number: 584-LT3065EDD#TRPBF; Mouser Price/Stock: https://www.mouser.co.uk/ProductDetail/Analog-Devices/LT3065EDDTRPBF?qs=hVkxg5c3xu9LuvC3J9QFFQ%3D%3D; Arrow Part Number: LT3065EDD#TRPBF; Arrow Price/Stock: https://www.arrow.com/en/products/lt3065eddtrpbf/analog-devices
IC?#3 = INA220AIDGSR: Integrated Circuit; Manufacturer_Name: Texas Instruments; Datasheet Link: http://componentsearchengine.com/Datasheets/1/INA220AIDGSR.pdf; Height: 1.1mm; Manufacturer_Part_Number: INA220AIDGSR; Mouser Part Number: 595-INA220AIDGSR; Mouser Price/Stock: https://www.mouser.co.uk/ProductDetail/Texas-Instruments/INA220AIDGSR?qs=nM5Sj1EaAzl3Pm1h3QWkPA%3D%3D; Arrow Part Number: INA220AIDGSR; Arrow Price/Stock: https://www.arrow.com/en/products/ina220aidgsr/texas-instruments
IC?#4 = LTM4649IY#PBF: Integrated Circuit; Manufacturer_Name: Linear Technology; Datasheet Link: https://www.analog.com/media/en/technical-documentation/data-sheets/4649fc.pdf; Height: 5.12mm; Manufacturer_Part_Number: LTM4649IY#PBF; Mouser Part Number: 584-LTM4649IY#PBF; Mouser Price/Stock: https://www.mouser.co.uk/ProductDetail/Analog-Devices-Linear-Technology/LTM4649IYPBF?qs=hVkxg5c3xu8ZgLPsK0YcDQ%3D%3D
IC?#5 = LTM4644IY#PBF: Integrated Circuit; Manufacturer_Name: Linear Technology; Datasheet Link: https://www.analog.com/media/en/technical-documentation/data-sheets/LTM4644-4644-1.pdf; Height: 5.21mm; Manufacturer_Part_Number: LTM4644IY#PBF; Mouser Part Number: 584-LTM4644IY#PBF; Mouser Price/Stock: https://www.mouser.co.uk/ProductDetail/Analog-Devices-Linear-Technology/LTM4644IYPBF?qs=hVkxg5c3xu%252BeaW6u5RazNw%3D%3D; Arrow Part Number: LTM4644IY#PBF; Arrow Price/Stock: https://www.arrow.com/en/products/ltm4644iypbf/linear-technology
IC?#6 = LTC3568EDD#PBF: Integrated Circuit; Manufacturer_Name: Linear Technology; Datasheet Link: https://www.analog.com/media/en/technical-documentation/data-sheets/3568fa.pdf; Height: 0.8mm; Manufacturer_Part_Number: LTC3568EDD#PBF
J? = PJ-082BH: 2.5 mm Center Pin, 10 A, Right Angle, Through Hole, Shielded, Dc Power Jack Connector; MF: {'manufacturer': u'CUI Devices'}; Value: *; Availability: Unavailable; Price: None; MP: PJ-082BH; Package: None
L?#1 L?#3 = CMP-0226-00043-1: SMD Flat Wire High Current Inductor WE-HCI, L=22.0 µH; Inductance: 22.0 ÂµH; ComponentLink1URL: http://www.we-online.com; ComponentLink2Description: Datasheet; PackageVersion: 2008; PackageReference: WE-HCI-1365; DatasheetVersion: ver 1, Aug-2009; PackageDescription: Inductor, 2-Leads, Body 13.2 x 12.8 mm; ComponentLink1Description: Manufacturer Link; ComponentLink2URL: http://www.we-online.de/katalog/media/pdf/7443551221.pdf
L?#2 = CMP-06045-000050-1: CMC 330MA 2LN 90 OHM SMD; Tolerance: 25%; Frequency: 100MHz; Shielding: Unshielded; Impedance: 90R; Number of Lines: 2; DC Resistance (DCR): 350mR; Voltage Rating: 50V; DC Current: 330mA; Current Rating: 330mA; Lead Free: Lead Free; Length: 2mm; Radiation Hardening: No; Max Operating Temperature: 85°C; Depth: 1.2mm; Weight: 0.000317oz; Height: 0.9mm; Termination: SMD/SMT; Min Operating Temperature: -40°C; Case/Package: 0805; Packaging: Tape and Reel; Width: 0.047inch; Test Frequency: 100MHz; Mount: Surface Mount; Current: 330mA; Military Standard: Not; Package Quantity: 1; Resistor Type: Wirewound; Case Code (Imperial): 0805; Max DC Current: 330mA
L?#4 = CMP-02424-000013-2: Commercial Inductors, Low DCR Series 1.5uH 48A 1.62mΩ 20%; Test Frequency: 100kHz; DC Resistance (DCR): 1.62mR; Max DC Current: 31A; Shielding: Shielded; Core Material: Metal; Self Resonant Frequency: 26MHz; Inductance: 1.5uH; Tolerance: 20%; Current Rating: 48A; Depth: 17.15mm; Lead Free: Lead Free; Min Operating Temperature: -55°C; Military Standard: Not; Max Operating Temperature: 125°C; Width: 0.675inch; Inductance Tolerance: 20%; Radiation Hardening: No; Number of Pins: 2; Package Quantity: 1; Height - Seated (Max): 0.276inch; Case/Package: 6767; RMS Current (Irms): 48A; Saturation Current: 31A; Termination: SMD/SMT; Height: 7mm; Length: 17.15mm; Packaging: Tape and Reel; Mount: Surface Mount
P? = CMP-2000-07492-1: Male Header, Pitch 2.54 mm, 1 x 2 Position, Height 8.21 mm, Tail Length 3.05 mm, -65 to 105 degC, RoHS, Bulk; Manufacturer: TE Connectivity; Mating Connector Lock: No(Without); Number of Positions: 2; Pitch: 2.54mm; PCB Mounting Orientation: Vertical; Keyed: No; Case\/Package: 100; Mating Post Length: 0.23inch; High Temperature Housing: Yes; Max Current Rating: 5A; PCB Thickness: 0.063inch; PCB Mount Retention: Without; Approvals: CSA; Current Rating: 3A; Radiation Hardening: No; Length: 4.67mm; Contact Mating Length: 0.23inch; Connector Type: Header; Number of Rows: 1; Termination Post Length: 0.12inch; Board Standoff: No(Without); Max Operating Temperature: 105degC; Contact Shape: Square; Selectively Loaded: No(Without); Gasket: No(Without); Number of Contacts: 2; Contact Gender: Male; Mating Alignment: No(Without); Manufacturer URL: http://www.te.com/; Datasheet URL: http://www.te.com/commerce/DocumentDelivery/DDEController?Action=showdoc&DocId=Customer+Drawing%7F146280%7FH1%7Fpdf%7FEnglish%7FENG_CD_146280_H1.pdf%7F5-146280-2; Mount: ThroughHole; Orientation: Straight; Packaging: Carton; Package Reference: 5-146280-2; Package Quantity: 500; Stabilizers: No(Without); Row Spacing: 2.54mm; Contact Material: CopperAlloy; Panel Mount Retention: No(Without); Datasheet Version: Rev. H1, 08/2016; Housing Colour: Black; Colour: Black; Package Description: Male Header, Pitch 2.54 mm, 1 x 2 Position, Height 8.21 mm, Tail Length 3.05 mm; Contact Plating: Matte; Housing Material: Polymer; Contact Protection: No(Without); Min Operating Temperature: -65degC; Mounting Technology: ThroughHole; Flammability Rating: UL94V-0; RoHSCompliant: true; Termination: ThroughHole; Depth: 2.34mm; High Speed Serial Data Connector: No
Q? = FDMS6681Z: MOSFET (P-Channel); Manufacturer_Name: ON Semiconductor; Datasheet Link: https://www.onsemi.com/pub/Collateral/FDMS6681Z-D.PDF; Height: 1.1mm; Manufacturer_Part_Number: FDMS6681Z; Mouser Part Number: 512-FDMS6681Z; Mouser Price/Stock: https://www.mouser.co.uk/ProductDetail/ON-Semiconductor-Fairchild/FDMS6681Z/?qs=eQsPqqG3NqYIemB4oC6BVw%3D%3D; Arrow Part Number: FDMS6681Z; Arrow Price/Stock: https://www.arrow.com/en/products/fdms6681z/on-semiconductor
R?#1 R?#2 = CMP-2002-00270-2: RES Thick Film, 91kΩ, 1%, 0.063W, 100ppm/°C, 0402; Power Rating: 63mW; Voltage Rating: 50V; Resistance: 91kR; Packaging: Tape and Reel; Max Operating Temperature: 155°C; Height: 0.35mm; Radiation Hardening: No; Tolerance: 1%; Number of Terminations: 2; Width: 0.02inch; Length: 1mm; Temperature Coefficient: 100ppm/°C; Features: Automotive AEC-Q200; Voltage Rating (DC): 50V; Weight: 2.3E-05oz; Min Operating Temperature: -55°C; Military Standard: Not; Max Power Dissipation: 63mW; Number of Pins: 2; Composition: Thick Film; Lead Free: Lead Free; Contact Plating: Tin; Case/Package: 0402; Termination: SMD/SMT; Package Quantity: 10; Case Code (Metric): 1005; Case Code (Imperial): 0402; Depth: 0.5mm
R?#3 R?#5 R?#8 R?#11 = CMP-2002-08123-3: RES Thick Film, 100kΩ, 1%, 0.063W, 100ppm/°C, 0402; Power Rating: 63mW; Resistance: 100kR; Voltage Rating (DC): 50V; Lead Free: Lead Free; Height: 0.35mm; Contact Plating: Tin; Min Operating Temperature: -55°C; Package Quantity: 10000; Case/Package: 0402; Temperature Coefficient: 100ppm/°C; Number of Terminations: 2; Packaging: Tape and Reel; Max Power Dissipation: 63mW; Case Code (Metric): 1005; Mount: Surface Mount; Width: 0.02inch; Termination: SMD/SMT; Length: 1mm; Number of Pins: 2; Weight: 2.3E-05oz; Radiation Hardening: No; Tolerance: 1%; Military Standard: Not; Features: Automotive AEC-Q200; Depth: 0.5mm; Composition: Thick Film; Max Operating Temperature: 155°C; Voltage Rating: 50V; Case Code (Imperial): 0402
R?#4 = CMP-2002-08276-2: RES Thick Film, 1kΩ, 1%, 0.063W, 100ppm/°C, 0402; Resistance: 1kR; Power Rating: 63mW; Voltage Rating (DC): 50V; Package Quantity: 10; Termination: SMD/SMT; Width: 0.5mm; Military Standard: Not; Length: 1mm; Contact Plating: Tin; Mount: Surface Mount; Packaging: Tape and Reel; Case Code (Imperial): 0402; Tolerance: 1%; Weight: 2.3E-05oz; Number of Pins: 2; Case/Package: 0402; Case Code (Metric): 1005; Lead Free: Lead Free; Number of Terminations: 2; Max Power Dissipation: 63mW; Depth: 0.5mm; Temperature Coefficient: 100ppm/°C; Max Operating Temperature: 155°C; Height: 0.35mm; Features: Automotive AEC-Q200; Composition: Thick Film; Radiation Hardening: No; Voltage Rating: 50V; Min Operating Temperature: -55°C
R?#6 R?#10 = CMP-2002-00139-1: Part Number: CRCW040260K4FKED; Manufacturer: Vishay Dale
R?#7 R?#13 R?#14 = CMP-2002-08122-2: RES Thick Film, 0Ω, 0.063W, 0402; Tolerance: 5%; Max Power Dissipation: 63mW; Voltage Rating: 50V; Temperature Coefficient: 100ppm/°C; Resistance: 0mR; Contact Plating: Tin; Height: 0.35mm; Radiation Hardening: No; Features: Automotive AEC-Q200; Composition: Thick Film; Width: 0.5mm; Weight: 2.3E-05oz; Termination: SMD/SMT; Packaging: Tape and Reel; Mount: Surface Mount; Case Code (Metric): 1005; Military Standard: Not; Min Operating Temperature: -55°C; Number of Terminations: 2; Package Quantity: 1; Case Code (Imperial): 0402; Depth: 0.5mm; Max Operating Temperature: 155°C; Case/Package: 0402; Power Rating: 63mW; Lead Free: Lead Free; Voltage Rating (DC): 50V; Length: 1mm
R?#9 R?#12 = CMP-2002-01009-1: Part Number: ERJ-2RKF6040X; Manufacturer: Panasonic
R?#15 R?#16 R?#20 R?#21 = CMP-2002-08143-1: Part Number: CRCW040210R0FKED; Manufacturer: Vishay Dale
R?#17 = CMP-26527-000005-1: RES 0.001 OHM 1% 5W 3920; Manufacturer Part Number: HCS3920FT1L00; Manufacturer: Stackpole Electronics; Automotive Grade: Grade 0; Temperature Coefficient: 50ppm/°C; Value: 1mΩ; Standoff Height: 0.4mm; Temperature Range High: +170°C; ComponentLink2URL: https://www.seielect.com/catalog/sei-hcs.pdf; Temperature Range Low: -55°C; Octopart: https://octopart.com/hcs3920ft1l00-stackpole+electronics-33343675; Lead Free: Yes; Power Rating: 5W; Category: Res; Package: 0; Tolerance: 1%; Composition: Metal Element; Height: 1.07mm; Resistance: 1mΩ; Digikey Description: RES 0.001 OHM 1% 5W 3920; Device Class L1: Passive Components; Series: HCS; Automotive: Yes; Device Class L3: Chip SMD Resistors; RoHS: TRUE; ComponentLink2Description: Datasheet; Device Class L2: Resistors; Temperature: -55°C to +170°C
R?#18 R?#24 = CMP-2002-03282-1: Part Number: CPF0402B3K16E1; Manufacturer: TE Connectivity / AMP
R?#19 R?#26 R?#32 = CMP-2000-07588-1: Chip Resistor, 10 KOhm, +/- 1%, 0.1 W, -55 to 155 degC, 0402 (1005 Metric), RoHS, Tape and Reel; Manufacturer: Panasonic; Power Rating: 100mW; Voltage Rating: 50V; Resistance: 10KOhm; Case\/Package: 0402; Temperature Coefficient: 100ppm\/degreesC; RoHSCompliant: True; Lead Free: LeadFree; Package Quantity: 1; Contact Plating: Tin; Length: 1mm; Radiation Hardening: No; REACH SVHC: NoSVHC; Max Operating Temperature: 155degC; Depth: 0.5mm; Case Code (Imperial): 0402; Military Standard: Not; Package Description: 2-Pin Surface Mount Device, Body 1 x 0.5 mm; Termination: SMD/SMT; Case Code (Metric): 1005; Height: 0.35mm; Packaging: TapeandReel; Voltage Rating (DC): 50V; Package Reference: 402; Number of Pins: 2; Tolerance: 1%; Mounting Technology: SurfaceMount; Width: 0.02inch; Mount: SurfaceMount; Datasheet URL: https://industrial.panasonic.com/cdbs/www-data/pdf/RDA0000/AOA0000C304.pdf; Composition: ThickFilm; Datasheet Version: 02/2017; Manufacturer URL: http://www.panasonic.com/; Max Power Dissipation: 100mW; Number of Terminations: 2; Min Operating Temperature: -55degC
R?#22 = CMP-2002-00116-2: RES Thick Film, 5.1kΩ, 5%, 0.063W, 200ppm/°C, 0402; Power Rating: 63mW; Voltage Rating: 50V; Resistance: 5.1kR; Case Code (Metric): 1005; Package Quantity: 1; Weight: 2.3E-05oz; Length: 1mm; Max Power Dissipation: 63mW; Contact Plating: Tin; Min Operating Temperature: -55°C; Depth: 0.5mm; Number of Pins: 2; Tolerance: 5%; Max Operating Temperature: 155°C; Width: 0.02inch; Case/Package: 0402; Features: Automotive AEC-Q200; Number of Terminations: 2; Packaging: Tape and Reel; Termination: SMD/SMT; Voltage Rating (DC): 50V; Radiation Hardening: No; Lead Free: Lead Free; Height: 0.35mm; Composition: Thick Film; Temperature Coefficient: 200ppm/°C; Case Code (Imperial): 0402; Military Standard: Not
R?#23 R?#35 = CMP-2002-01154-4: Chip Resistor, 4.7 KOhm, +/- 1%, 0.1 W, -55 to 155 degC, 0402 (1005 Metric), RoHS, Tape and Reel; PartNumber: ERJ-2RKF4701X; Voltage Rating: 50 V; Case\/Package: 0402; Power Rating: 100 mW; Height: 0.35 mm; Mounting Technology: Surface Mount; REACH SVHC: Yes; Resistance: 4.7 KOhm; Max Operating Temperature: 155 degC; ComponentLink1Description: Manufacturer URL; ComponentLink2Description: Datasheet; Pins: 2; PackageReference: 0402; Tolerance: 1%; Case Code (Imperial): 0402; Length: 1 mm; PackageDescription: 2-Pin Surface Mount Device, Body 1 x 0.5 mm; RoHSCompliant: true; Package Quantity: 1; Radiation Hardening: No; DatasheetVersion: 04/2015; Width: 0.5 mm; Case Code (Metric): 1005; Mount: Surface Mount; ComponentLink1URL: http://www.panasonic.com/; Min Operating Temperature: -55 degC; Packaging: Cut Tape; ComponentLink2URL: http://industrial.panasonic.com/cdbs/www-data/pdf/RDA0000/AOA0000C86.pdf
R?#25 = CMP-2002-00694-4: RES SMD 15K OHM 1% 1/10W 0402; Manufacturer Part Number: ERJ-2RKF1502X; Manufacturer: Panasonic; Automotive Grade: Grade 0; Voltage Rating: 50V; Resistance: 15kΩ; Temperature Coefficient: 100ppm/°C; Power Rating: 0.1W; Value: 15kΩ; ComponentLink2URL: https://industrial.panasonic.com/cdbs/www-data/pdf/RDA0000/AOA0000C304.pdf; Automotive: Yes; Temperature: -55°C to +155°C; Height: 0.4mm; Digikey Description: RES SMD 15K OHM 1% 1/10W 0402; Category: Res; Device Class L2: Resistors; Device Class L1: Passive Components; Package: ERJ2R; Temperature Range Low: -55°C; Tolerance: 1%; Series: ERJ; Footprint Url: https://b2b-api.panasonic.eu/file_stream/pids/fileversion/1180; Mouser Description: Res Thick Film 1.0 x 0.5 mm 15K Ohm 1% 0.1W(1/10W) 100ppm/ C Molded SMD Punched Carrier T/R; Composition: Thick Film; Lead Free: Yes; Device Class L3: Chip SMD Resistors; Octopart: https://octopart.com/erj-2rkf1502x-panasonic-55404985; RoHS: TRUE; Temperature Range High: +155°C; ComponentLink2Description: Datasheet
R?#27 = CMP-2002-08584-2: RES Thick Film, 3.48kΩ, 1%, 0.063W, 100ppm/°C, 0402; Power Rating: 63mW; Voltage Rating: 50V; Resistance: 3.48kR; Number of Pins: 2; Case/Package: 0402; Width: 0.5mm; Min Operating Temperature: -55°C; Case Code (Imperial): 0402; Max Power Dissipation: 63mW; Packaging: Tape and Reel; Weight: 2.3E-05oz; Temperature Coefficient: 100ppm/°C; Features: Automotive AEC-Q200; Tolerance: 1%; Package Quantity: 10; Case Code (Metric): 1005; Contact Plating: Tin; Max Operating Temperature: 155°C; Number of Terminations: 2; Radiation Hardening: No; Height: 0.35mm; Composition: Thick Film; Length: 1mm; Depth: 0.5mm; Military Standard: Not; Termination: SMD/SMT
R?#28 = CMP-2002-00178-1: Part Number: CRCW040269K8FKED; Manufacturer: Vishay Dale
R?#29 = CMP-2002-01059-1: Part Number: ERJ-2RKF7502X; Manufacturer: Panasonic
R?#30 = CMP-2002-00249-1: Part Number: CRCW0402887KFKED; Manufacturer: Vishay Dale
R?#31 = CMP-1665-00029-2: Chip Resistor, 324 KOhm, +/- 1%, 0.1 W, -55 to 155 degC, 0402 (1005 Metric), RoHS, Tape and Reel; PartNumber: ERJ-2RKF3243X; DatasheetVersion: 04/2015; Mounting Technology: Surface Mount; Resistance: 324 KOhm; ComponentLink2URL: http://industrial.panasonic.com/cdbs/www-data/pdf/RDA0000/AOA0000C86.pdf; PackageDescription: 2-Pin Surface Mount Device, Body 1 x 0.5 mm; Length: 1 mm; REACH SVHC: Yes; Case Code (Metric): 1005; Case/Package: 0402; ComponentLink2Description: Datasheet; Height: 0.35 mm; RoHSCompliant: True; Max Operating Temperature: 155 degC; Packaging: Tape and Reel; Case Code (Imperial): 0402; Tolerance: 1%; ComponentLink1URL: http://www.panasonic.com/; Min Operating Temperature: -55 degC; Width: 0.5 mm; Package Quantity: 10000; ComponentLink1Description: Manufacturer URL
R?#33 = CMP-2002-08619-1: Manufacturer: Vishay Dale; Part Number: CRCW0402412KFKED
R?#34 = CMP-2001-04899-2: RES Thick Film, 100kΩ, 1%, 0.125W, 100ppm/°C, 0805; Resistance: 100kR; Power Rating: 125mW; Voltage Rating: 150V; Case/Package: 0805; Max Operating Temperature: 155°C; Case Code (Imperial): 0805; Lead Free: Lead Free; Weight: 0.000194oz; Number of Pins: 2; Package Quantity: 5000; Height: 0.45mm; Composition: Thick Film; Military Standard: Not; Tolerance: 1%; Case Code (Metric): 2012; Termination: SMD/SMT; Mount: Surface Mount; Radiation Hardening: No; Width: 1.25mm; Length: 2mm; Depth: 1.25mm; Packaging: Tape and Reel; Min Operating Temperature: -55°C; Contact Plating: Tin; Temperature Coefficient: 100ppm/°C; Voltage Rating (DC): 150V
U?#1-U?#10 = CMP-0859-00406-3: Single Buffer/Driver With Open-Drain Output, DCK0005A, SMALL T&R; Manufacturer: Texas Instruments; Input Type: CMOS; F @ Nom Voltage(Max)(Mhz): 250; Rating: Catalog; Bits(#): 1; Schmitt Trigger: No; VCC(Min)(V): 0.8; tpd @ Nom Voltage(Max)(ns): 4.7,3.3,2.4,2.3,1.8; Output Drive (IOL/IOH)(Max)(mA): 9/-9; VCC(Max)(V): 2.7; Technology Family: AUC; ICC @ Nom Voltage(Max)(mA): 0.01; Voltage(Nom)(V): 0.8,1.2,1.5,1.8,2.5; Sub-Family: Non-Inverting Buffer/Driver; Logic: True; DatasheetVersion: SCES373Q; 3-State Output: No; Operating Temperature Range(C): -40 to 85; Generic Part Number: SN74AUC1G07; PackageReference: DCK0005A; Output Type: CMOS